# Altium schematic sheet 04_PS.SchDoc
size A3
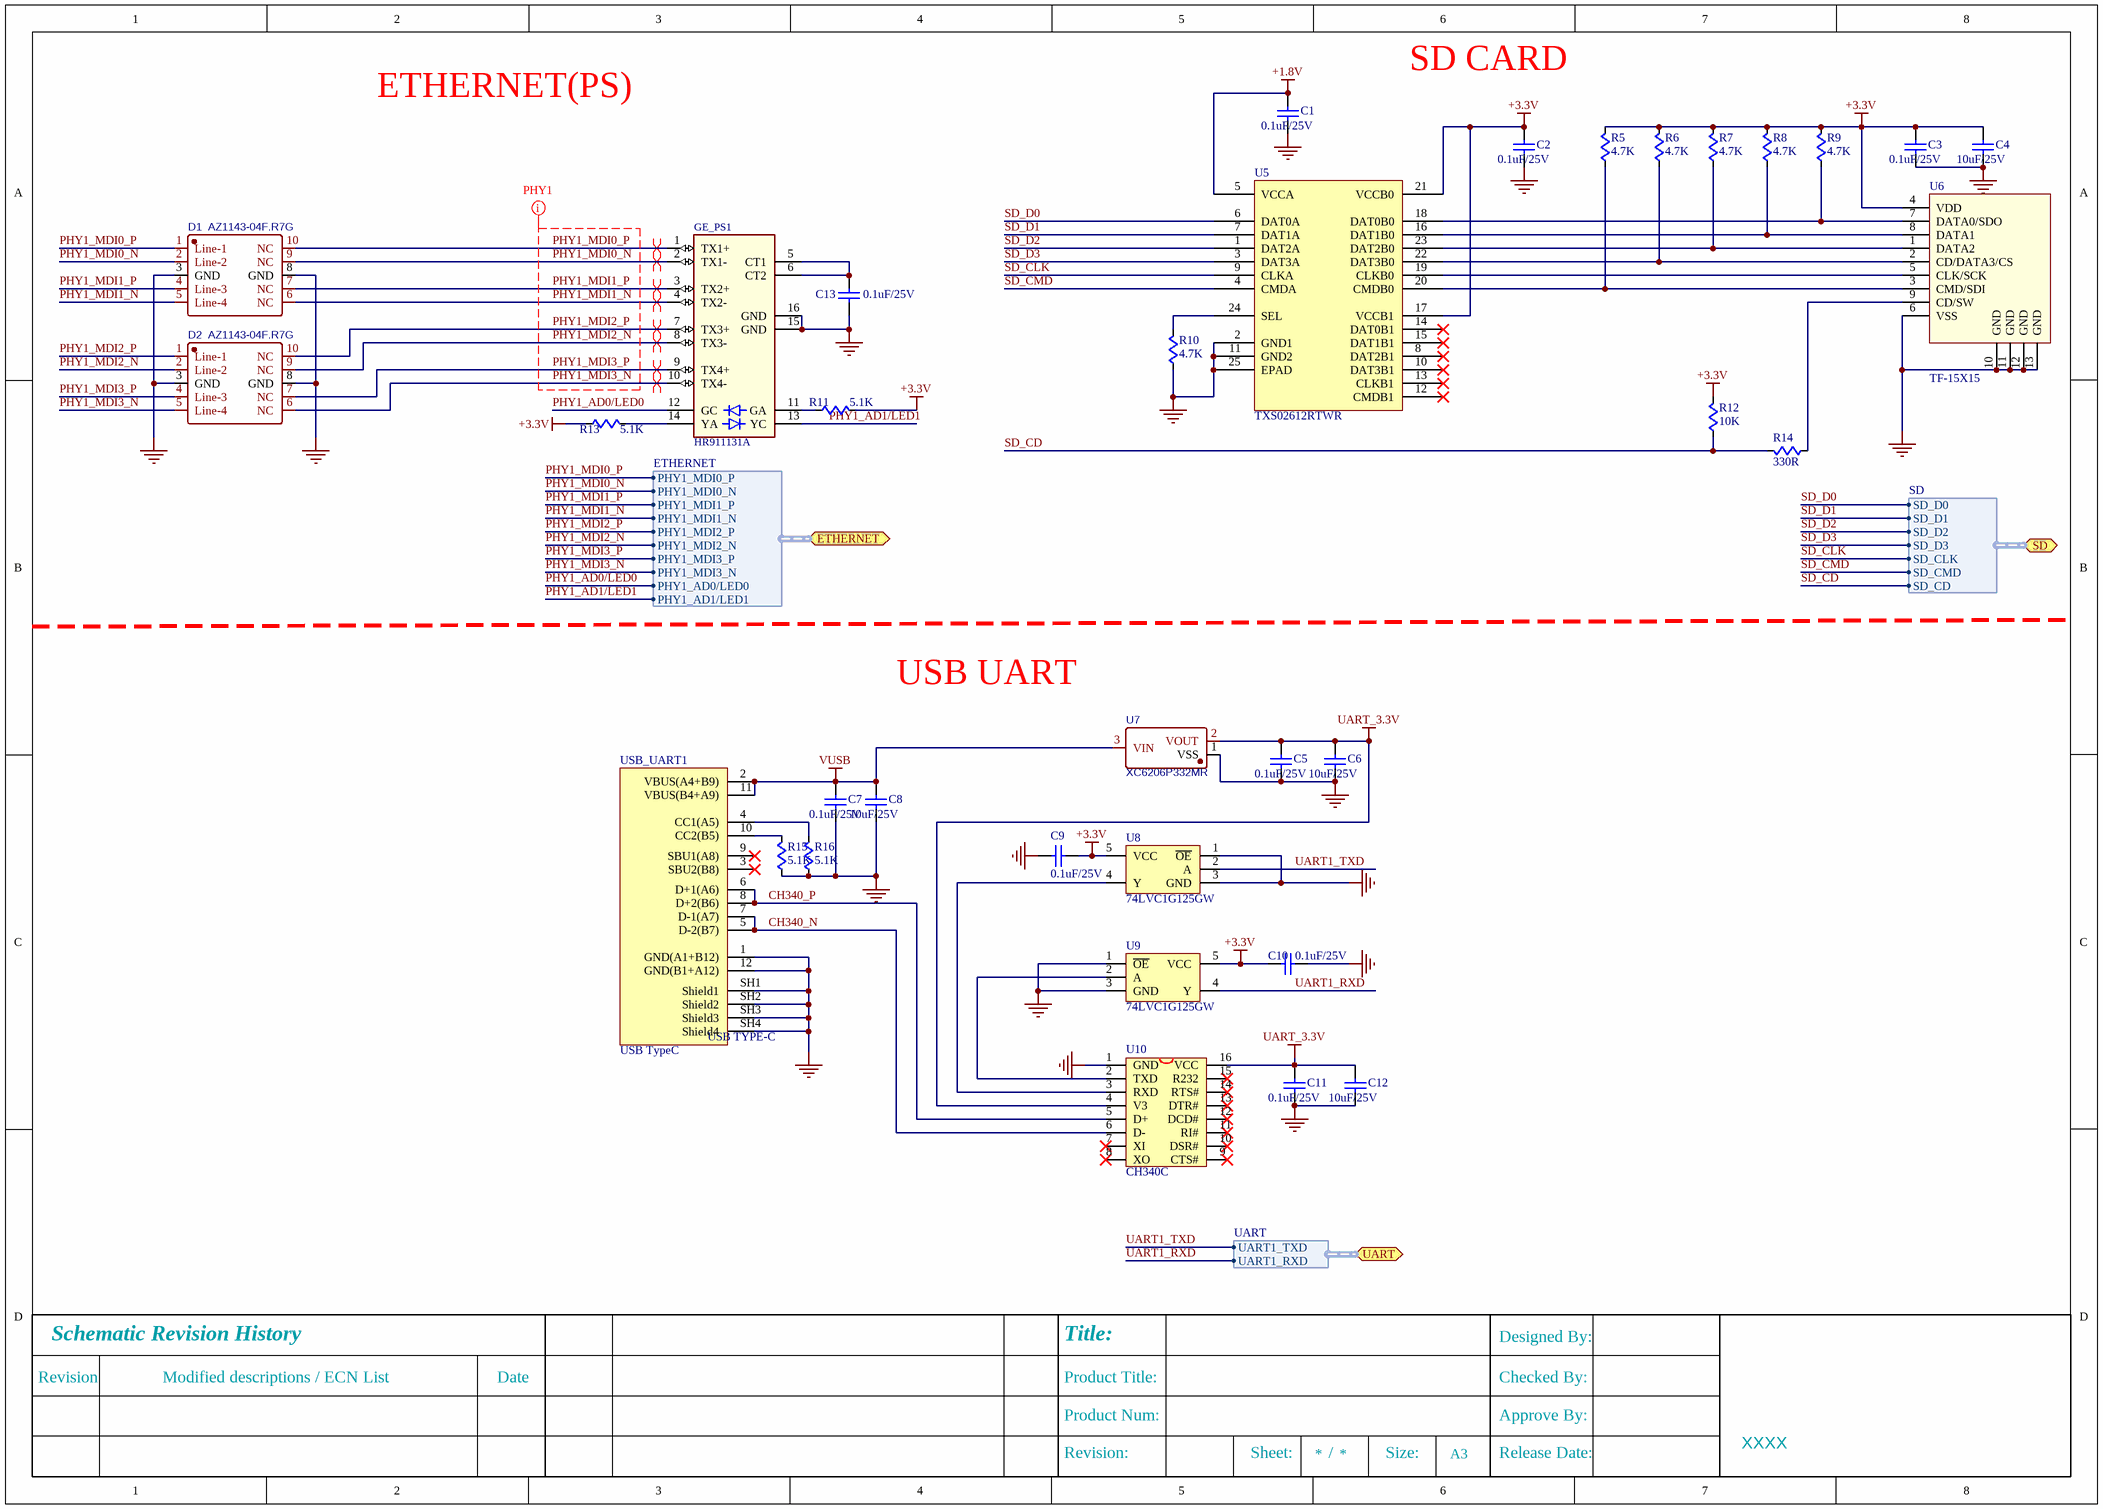
[diagram p0: 04_PS.SchDoc]

## Parts
C1  0.1uF/25V  [C0603]
C2  0.1uF/25V  [C0603]
C3  0.1uF/25V  [C0603]
C4  10uF/25V  [C1206]
C5  0.1uF/25V  [C0603]
C6  10uF/25V  [C1206]
C7  0.1uF/25V  [C0603]
C8  10uF/25V  [C1206]
C9  0.1uF/25V  [C0603]
C10  0.1uF/25V  [C0603]
C11  0.1uF/25V  [C0603]
C12  10uF/25V  [C1206]
C13  0.1uF/25V  [0603C]
D1  AZ1143-04F.R7G  [DFN2510P10E]
D2  AZ1143-04F.R7G  [DFN2510P10E]
GE_PS1  HR911131A  [HR911131A]
R5  4.7K  [R0603]
R6  4.7K  [R0603]
R7  4.7K  [R0603]
R8  4.7K  [R0603]
R9  4.7K  [R0603]
R10  4.7K  [R0603]
R11  5.1K  [R0603]
R12  10K  [R0603]
R13  5.1K  [R0603]
R14  330R  [R0603]
R15  5.1K  [R0603]
R16  5.1K  [R0603]
U5  TXS02612RTWR  [QFN24_RTW]
U6  TF-15X15  [Micro SD]
U7  XC6206P332MR  [SOT-23]
U8  74LVC1G125GW  [SOT353-L]
U9  74LVC1G125GW  [SOT353-L]
U10  CH340C  [SOP16M]
USB_UART1  USB TypeC  [USB Type-C]

## Ports
ETHERNET (bidir, harness ETHERNET), SD (bidir, harness SD), UART (bidir, harness UART)

## Harnesses
SD: SD_D0, SD_D1, SD_D2, SD_D3, SD_CLK, SD_CMD, SD_CD
UART: UART1_TXD, UART1_RXD
ETHERNET: PHY1_MDI0_P, PHY1_MDI0_N, PHY1_MDI1_P, PHY1_MDI1_N, PHY1_MDI2_P, PHY1_MDI2_N, PHY1_MDI3_P, PHY1_MDI3_N, PHY1_AD0/LED0, PHY1_AD1/LED1

## Nets
+1.8V: C1.1 U5.5(VCCA)
+3.3V: C2.1 C3.1 C4.1 C9.2 C10.1 R5.2 R6.2 R7.2 R8.2 R9.2 R11.2 R12.2 R13.1 U5.17(VCCB1) U5.21(VCCB0) U6.4(VDD) U8.5(VCC) U9.5(VCC)
GND: C1.2 C2.2 C3.2 C4.2 C5.2 C6.2 C7.2 C8.2 C9.1 C10.2 C11.2 C12.2 C13.1 D1.3(GND) D1.8(GND) D2.3(GND) D2.8(GND) GE_PS1.15(GND) GE_PS1.16(GND) R10.1 R15.1 R16.1 U5.2(GND1) U5.11(GND2) U5.25(EPAD) U6.6(VSS) U6.10(GND) U6.11(GND) U6.12(GND) U6.13(GND) U7.1(VSS) U8.1(~{OE}) U8.3(GND) U9.1(~{OE}) U9.3(GND) U10.1(GND) USB_UART1.1(GND(A1+B12)) USB_UART1.12(GND(B1+A12)) USB_UART1.SH1(Shield1) USB_UART1.SH2(Shield2) USB_UART1.SH3(Shield3) USB_UART1.SH4(Shield4)
UART_3.3V: C5.1 C6.1 C11.1 C12.1 U7.2(VOUT) U10.4(V3) U10.16(VCC)
VUSB: C7.1 C8.1 U7.3(VIN) USB_UART1.2(VBUS(A4+B9)) USB_UART1.11(VBUS(B4+A9))
CH340_N: U10.6(D-) USB_UART1.5(D-2(B7)) USB_UART1.7(D-1(A7))
CH340_P: U10.5(D+) USB_UART1.6(D+1(A6)) USB_UART1.8(D+2(B6))
PHY1_AD0/LED0: GE_PS1.12(GC) ; port ETHERNET.PHY1_AD0/LED0
PHY1_AD1/LED1: GE_PS1.13(YC) ; port ETHERNET.PHY1_AD1/LED1
PHY1_MDI0_N: D1.2(Line-2) D1.9(NC) GE_PS1.2(TX1-) ; port ETHERNET.PHY1_MDI0_N
PHY1_MDI0_P: D1.1(Line-1) D1.10(NC) GE_PS1.1(TX1+) ; port ETHERNET.PHY1_MDI0_P
PHY1_MDI1_N: D1.5(Line-4) D1.6(NC) GE_PS1.4(TX2-) ; port ETHERNET.PHY1_MDI1_N
PHY1_MDI1_P: D1.4(Line-3) D1.7(NC) GE_PS1.3(TX2+) ; port ETHERNET.PHY1_MDI1_P
PHY1_MDI2_N: D2.2(Line-2) D2.9(NC) GE_PS1.8(TX3-) ; port ETHERNET.PHY1_MDI2_N
PHY1_MDI2_P: D2.1(Line-1) D2.10(NC) GE_PS1.7(TX3+) ; port ETHERNET.PHY1_MDI2_P
PHY1_MDI3_N: D2.5(Line-4) D2.6(NC) GE_PS1.10(TX4-) ; port ETHERNET.PHY1_MDI3_N
PHY1_MDI3_P: D2.4(Line-3) D2.7(NC) GE_PS1.9(TX4+) ; port ETHERNET.PHY1_MDI3_P
SD_CD: R12.1 R14.2 ; port SD.SD_CD
SD_CLK: U5.9(CLKA) ; port SD.SD_CLK
SD_CMD: U5.4(CMDA) ; port SD.SD_CMD
SD_D0: U5.6(DAT0A) ; port SD.SD_D0
SD_D1: U5.7(DAT1A) ; port SD.SD_D1
SD_D2: U5.1(DAT2A) ; port SD.SD_D2
SD_D3: U5.3(DAT3A) ; port SD.SD_D3
UART1_RXD: U9.4(Y) ; port UART.UART1_RXD
UART1_TXD: U8.2(A) ; port UART.UART1_TXD
NetC13_2: C13.2 GE_PS1.5(CT1) GE_PS1.6(CT2)
NetGE_PS1_11: GE_PS1.11(GA) R11.1
NetGE_PS1_14: GE_PS1.14(YA) R13.2
NetR5_1: R5.1 U5.20(CMDB0) U6.3(CMD/SDI)
NetR6_1: R6.1 U5.22(DAT3B0) U6.2(CD/DATA3/CS)
NetR7_1: R7.1 U5.23(DAT2B0) U6.1(DATA2)
NetR8_1: R8.1 U5.16(DAT1B0) U6.8(DATA1)
NetR9_1: R9.1 U5.18(DAT0B0) U6.7(DATA0/SDO)
NetR10_2: R10.2 U5.24(SEL)
NetR14_1: R14.1 U6.9(CD/SW)
NetR15_2: R15.2 USB_UART1.10(CC2(B5))
NetR16_2: R16.2 USB_UART1.4(CC1(A5))
NetU5_19: U5.19(CLKB0) U6.5(CLK/SCK)
NetU8_4: U8.4(Y) U10.3(RXD)
NetU9_2: U9.2(A) U10.2(TXD)

Not connected (* = marked no-connect by the designer): U5 8(DAT2B1)* 10(DAT3B1)* 12(CMDB1)* 13(CLKB1)* 14(DAT0B1)* 15(DAT1B1)*; U10 7(XI)* 8(XO)* 9(CTS#)* 10(DSR#)* 11(RI#)* 12(DCD#)* 13(DTR#)* 14(RTS#)* 15(R232)*; USB_UART1 3(SBU2(B8))* 9(SBU1(A8))*

## Layout directives
differential pair: PHY1_MDI0_N, PHY1_MDI0_P, PHY1_MDI1_N, PHY1_MDI1_P, PHY1_MDI2_N, PHY1_MDI2_P, PHY1_MDI3_N, PHY1_MDI3_P
net class PHY1: PHY1_MDI0_N, PHY1_MDI0_P, PHY1_MDI1_N, PHY1_MDI1_P, PHY1_MDI2_N, PHY1_MDI2_P, PHY1_MDI3_N, PHY1_MDI3_P

## Notes on the sheet
- ETHERNET(PS)
- SD CARD
- USB UART
- Revision
- Schematic Revision History
- Modified descriptions / ECN List
- Date
- Product Title:
- Title:
- Checked By:
- Designed By:
- Revision:
- Product Num:
- Sheet:
- /
- Size:
- A3
- Approve By:
- Release Date:
- XXXX
- Title
- Date:
- Number:
- Time:
- Sheet
- of
- File:
- (in symbol USB Type-C) USB TYPE-C

## Library data of the parts
C1-C12 = C: MLCC
C13 = Cap Semi: X7R/C0G贴片电容; Value: 0.1uF; 1-物料编码: 150203068; 1-物料描述: SMT电容0402_X7R_100nF_25V_K_FengHua_EHRA
D1 D2 = AZ1045-04F.R7G: ESD芯片，台舟电子，TPAZ1143-04F; BOM_Manufacturer: AMAZING; Contributor: LCSC; BOM_Supplier: LCSC; BOM_Supplier Part: C356811; BOM_Manufacturer Part: AZ1045-04F.R7G; spicePre: D; spiceSymbolName: AZ1045-04F.R7G
GE_PS1 = HR911131A/C: 千兆以太网接口
R5-R16 = R: 贴片电阻
U5 = TXS02612RTWR: 集成电路
U6 = Micro SD: Micro SD卡,硕方：TF-15X15; 版权归属: 源创客; BOM名称: Micro SD卡; 学习资源: www.ooocke.com
U7 = XC6206P332MR_C347376: 集成电路; BOM_Manufacturer: Youtai Semiconductor Co., Ltd.; Contributor: LCSC; SMT Type: Extend; BOM_Supplier: LCSC; BOM_Supplier Part: C347376; BOM_Manufacturer Part: XC6206P332MR; BOM_LCSC Assembly: Yes; spicePre: U; spiceSymbolName: XC6206P332MR_C347376
U8 U9 = 74LVC1G125GW: 1路 非反向三态缓冲器 低有效
U10 = CH340G: USB2UART
USB_UART1 = USB Type-C: 12P TypeC 母座，参考购买链接https://item.szlcsc.com/147739.html